# EAGLE design VCA-v2.1 (EAGLE 6.6.0)

## Sheet 1 of 2: Power
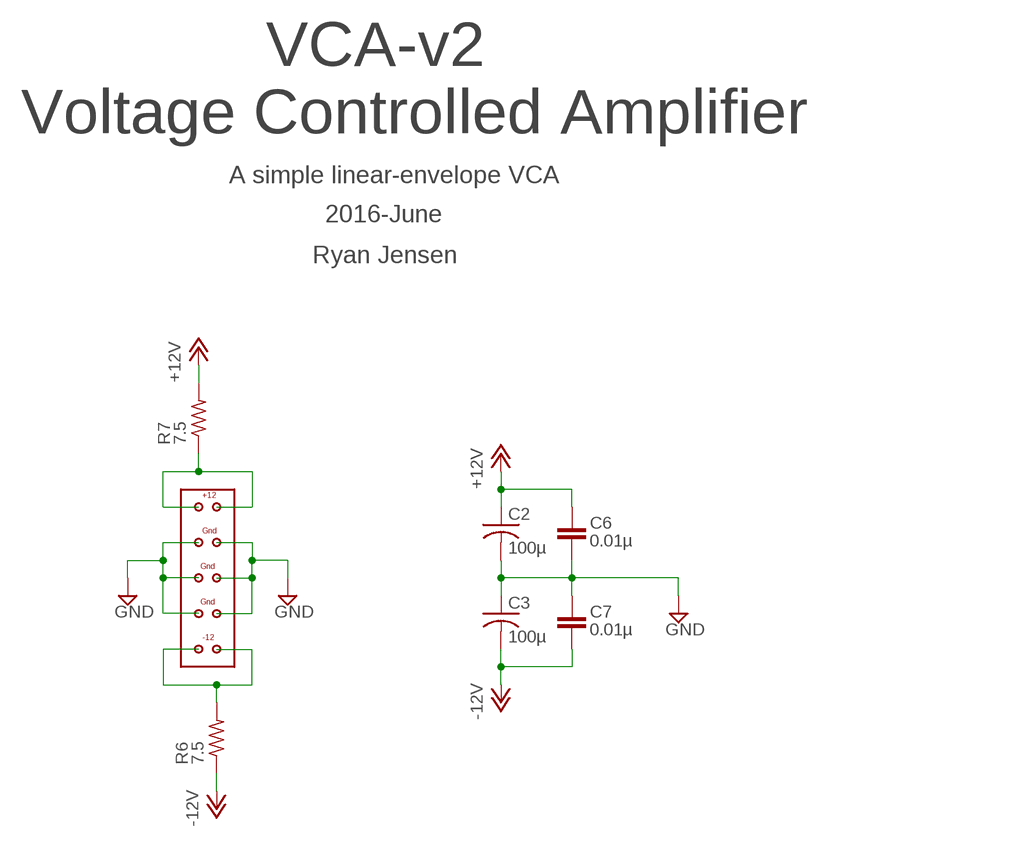
[diagram p0: schematic, sheet 1]

### Parts
C2  100µ  C-US025-050X050  [C025-050X050]
C3  100µ  C-US025-050X050  [C025-050X050]
C6  0.01µ  C-EUC0603  [C0603]
C7  0.01µ  C-EUC0603  [C0603]
R6  7.5  R-US_R0603  [R0603]
R7  7.5  R-US_R0603  [R0603]
U$1  EURORACK-POWER  [EURORACK-POWER]

### Nets
+12V: C2.1 C6.1 R7.2 ; also sheet 2
-12V: C3.2 C7.2 R6.1 ; also sheet 2
GND: C2.2 C3.1 C6.2 C7.1 U$1.P$3 U$1.P$4 U$1.P$5 U$1.P$6 U$1.P$7 U$1.P$8 ; also sheet 2
N$8: R6.2 U$1.P$9 U$1.P$10
N$10: R7.1 U$1.P$1 U$1.P$2

### Notes on the sheet
- VCA-v2
  Voltage Controlled Amplifier
- A simple linear-envelope VCA
- 2016-June
- Ryan Jensen

## Sheet 2 of 2
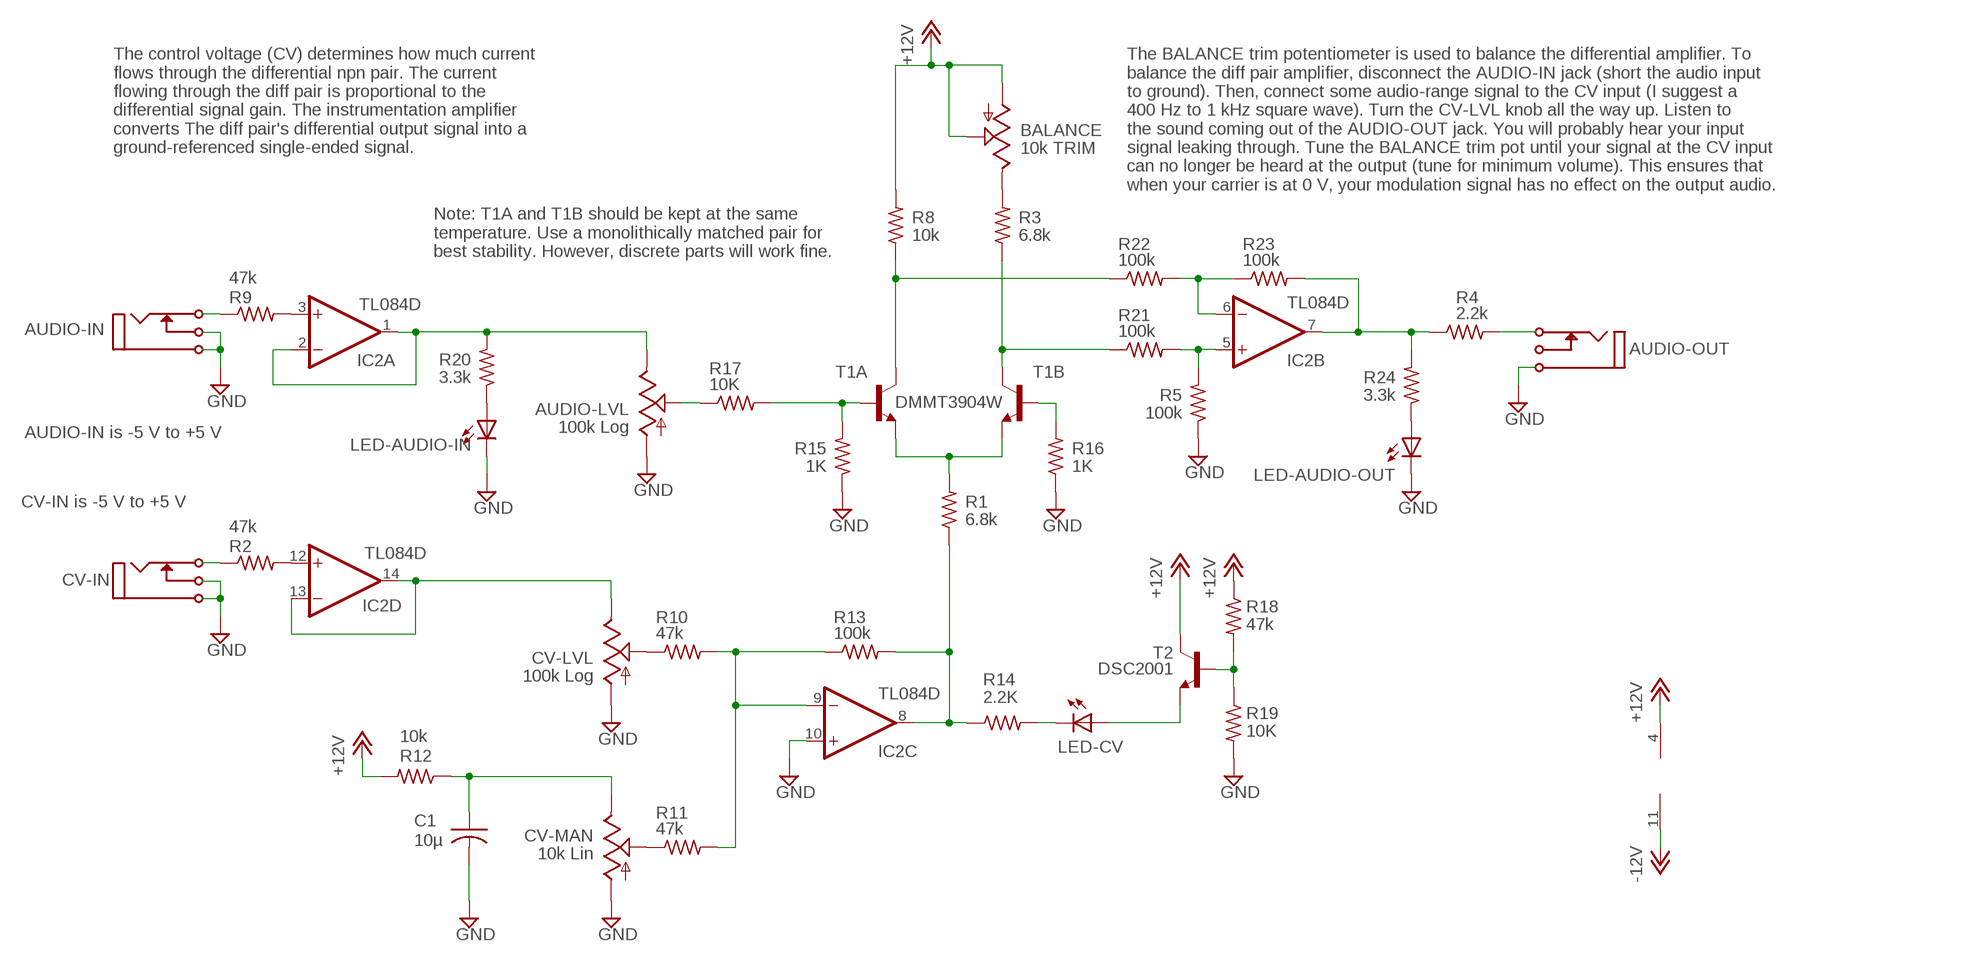
[diagram p1: schematic, sheet 2]

### Parts
AUDIO-IN  I/O  MONO_JACK  [MONO_JACK]
AUDIO-LVL  100k Log  TRIM_US-B64Y  [B64Y]
AUDIO-OUT  I/O  MONO_JACK  [MONO_JACK]
BALANCE  10k TRIM  TRIM_US-B64Y  [B64Y]
C1  10µ  C-US025-050X050  [C025-050X050]
CV-IN  I/O  MONO_JACK  [MONO_JACK]
CV-LVL  100k Log  TRIM_US-B64Y  [B64Y]
CV-MAN  10k Lin  TRIM_US-B64Y  [B64Y]
IC2  TL084D  [SO14]
LED-AUDIO-IN  TLLG4400  [LED3MM]
LED-AUDIO-OUT  TLLG4400  [LED3MM]
LED-CV  TLLG4400  [LED3MM]
R1  6.8k  R-US_R0603  [R0603]
R2  47k  R-US_R0603  [R0603]
R3  6.8k  R-US_R0603  [R0603]
R4  2.2k  R-US_R0603  [R0603]
R5  100k  R-US_R0603  [R0603]
R8  10k  R-US_R0603  [R0603]
R9  47k  R-US_R0603  [R0603]
R10  47k  R-US_R0603  [R0603]
R11  47k  R-US_R0603  [R0603]
R12  10k  R-US_R0603  [R0603]
R13  100k  R-US_R0603  [R0603]
R14  2.2K  R-US_R0603  [R0603]
R15  1K  R-US_R0603  [R0603]
R16  1K  R-US_R0603  [R0603]
R17  10K  R-US_R0603  [R0603]
R18  47k  R-US_R0603  [R0603]
R19  10K  R-US_R0603  [R0603]
R20  3.3k  R-US_R0603  [R0603]
R21  100k  R-US_R0603  [R0603]
R22  100k  R-US_R0603  [R0603]
R23  100k  R-US_R0603  [R0603]
R24  3.3k  R-US_R0603  [R0603]
T1  DMMT3904W  [SOT363]
T2  DSC2001  MMBT2222ALT1-NPN-SOT23-BEC  [SOT23-BEC]

### Nets
+12V: BALANCE.A BALANCE.S IC2.4(P:V+) R8.2 R12.2 R18.1 T2.C ; also sheet 1
-12V: IC2.11(P:V-) ; also sheet 1
GND: AUDIO-IN.P$1 AUDIO-IN.P$3(P3) AUDIO-LVL.A AUDIO-OUT.P$1 C1.2 CV-IN.P$1 CV-IN.P$3(P3) CV-LVL.A CV-MAN.A IC2.10(C:+IN) LED-AUDIO-IN.K(C) LED-AUDIO-OUT.K(C) R5.1 R15.1 R16.1 R19.2 ; also sheet 1
LED_SUPPLY: LED-CV.A T2.E
N$1: IC2.8(C:OUT) R1.1 R13.2 R14.1
N$2: BALANCE.E R3.2
N$3: IC2.12(D:+IN) R2.2
N$4: CV-LVL.E IC2.13(D:-IN) IC2.14(D:OUT)
N$5: CV-IN.P$2(P2) R2.1
N$6: AUDIO-IN.P$2(P2) R9.1
N$7: IC2.3(A:+IN) R9.2
N$9: AUDIO-LVL.E IC2.1(A:OUT) IC2.2(A:-IN) R20.2
N$11: CV-LVL.S R10.1
N$12: LED-CV.K(C) R14.2
N$13: CV-MAN.S R11.1
N$14: C1.1 CV-MAN.E R12.1
N$15: R1.2 T1.4(B:E) T1.5(A:E)
N$16: R15.2 R17.2 T1.1(A:B)
N$17: IC2.9(C:-IN) R10.2 R11.2 R13.1
N$18: AUDIO-LVL.S R17.1
N$19: R16.2 T1.2(B:B)
N$20: R18.2 R19.1 T2.B
N$21: LED-AUDIO-IN.A R20.1
N$22: LED-AUDIO-OUT.A R24.1
N$24: R8.1 R22.1 T1.6(A:C)
N$26: R3.1 R21.1 T1.3(B:C)
N$28: IC2.5(B:+IN) R5.2 R21.2
N$30: IC2.6(B:-IN) R22.2 R23.1
N$31: IC2.7(B:OUT) R4.1 R23.2 R24.2
N$32: AUDIO-OUT.P$2(P2) R4.2
Unconnected: AUDIO-OUT.P$3(P3)

### Notes on the sheet
- The control voltage (CV) determines how much current
  flows through the differential npn pair. The current
  flowing through the diff pair is proportional to the
  differential signal gain. The instrumentation amplifier
  converts The diff pair's differential output signal into a
  ground-referenced single-ended signal.
- The BALANCE trim potentiometer is used to balance the differential amplifier. To
  balance the diff pair amplifier, disconnect the AUDIO-IN jack (short the audio input
  to ground). Then, connect some audio-range signal to the CV input (I suggest a
  400 Hz to 1 kHz square wave). Turn the CV-LVL knob all the way up. Listen to
  the sound coming out of the AUDIO-OUT jack. You will probably hear your input
  signal leaking through. Tune the BALANCE trim pot until your signal at the CV input
  can no longer be heard at the output (tune for minimum volume). This ensures that
  when your carrier is at 0 V, your modulation signal has no effect on the output audio.
- Note: T1A and T1B should be kept at the same
  temperature. Use a monolithically matched pair for
  best stability. However, discrete parts will work fine.
- AUDIO-IN is -5 V to +5 V
- CV-IN is -5 V to +5 V

## Library data of the parts
AUDIO-IN AUDIO-OUT CV-IN = !synth_sch:MONO_JACK
AUDIO-LVL BALANCE CV-LVL CV-MAN = pot:TRIM_US-: POTENTIOMETER
C1-C3 = rcl:C-US: CAPACITOR, American symbol
C6 C7 = rcl:C-EU: CAPACITOR, European symbol
IC2 = linear:TL084: OP AMP
LED-AUDIO-IN LED-AUDIO-OUT LED-CV = led:TLLG4400: Low Current (2mA) LED 3 mm Tinted Diffused Package color GREEN Source: Data sheet <http://www.farnell.com/datasheets/391098.pdf>; MF: VISHAY SEMICONDUCTOR; OC_FARNELL: 1612435
R1-R24 = resistor:R-US_: RESISTOR, American symbol
T1 = !synth_sch:DMMT3904W
T2 = transistor:*-NPN-: NPN Transistror BF959 corrected 2008.03.06
U$1 = !synth_sch:EURORACK-POWER

## Board
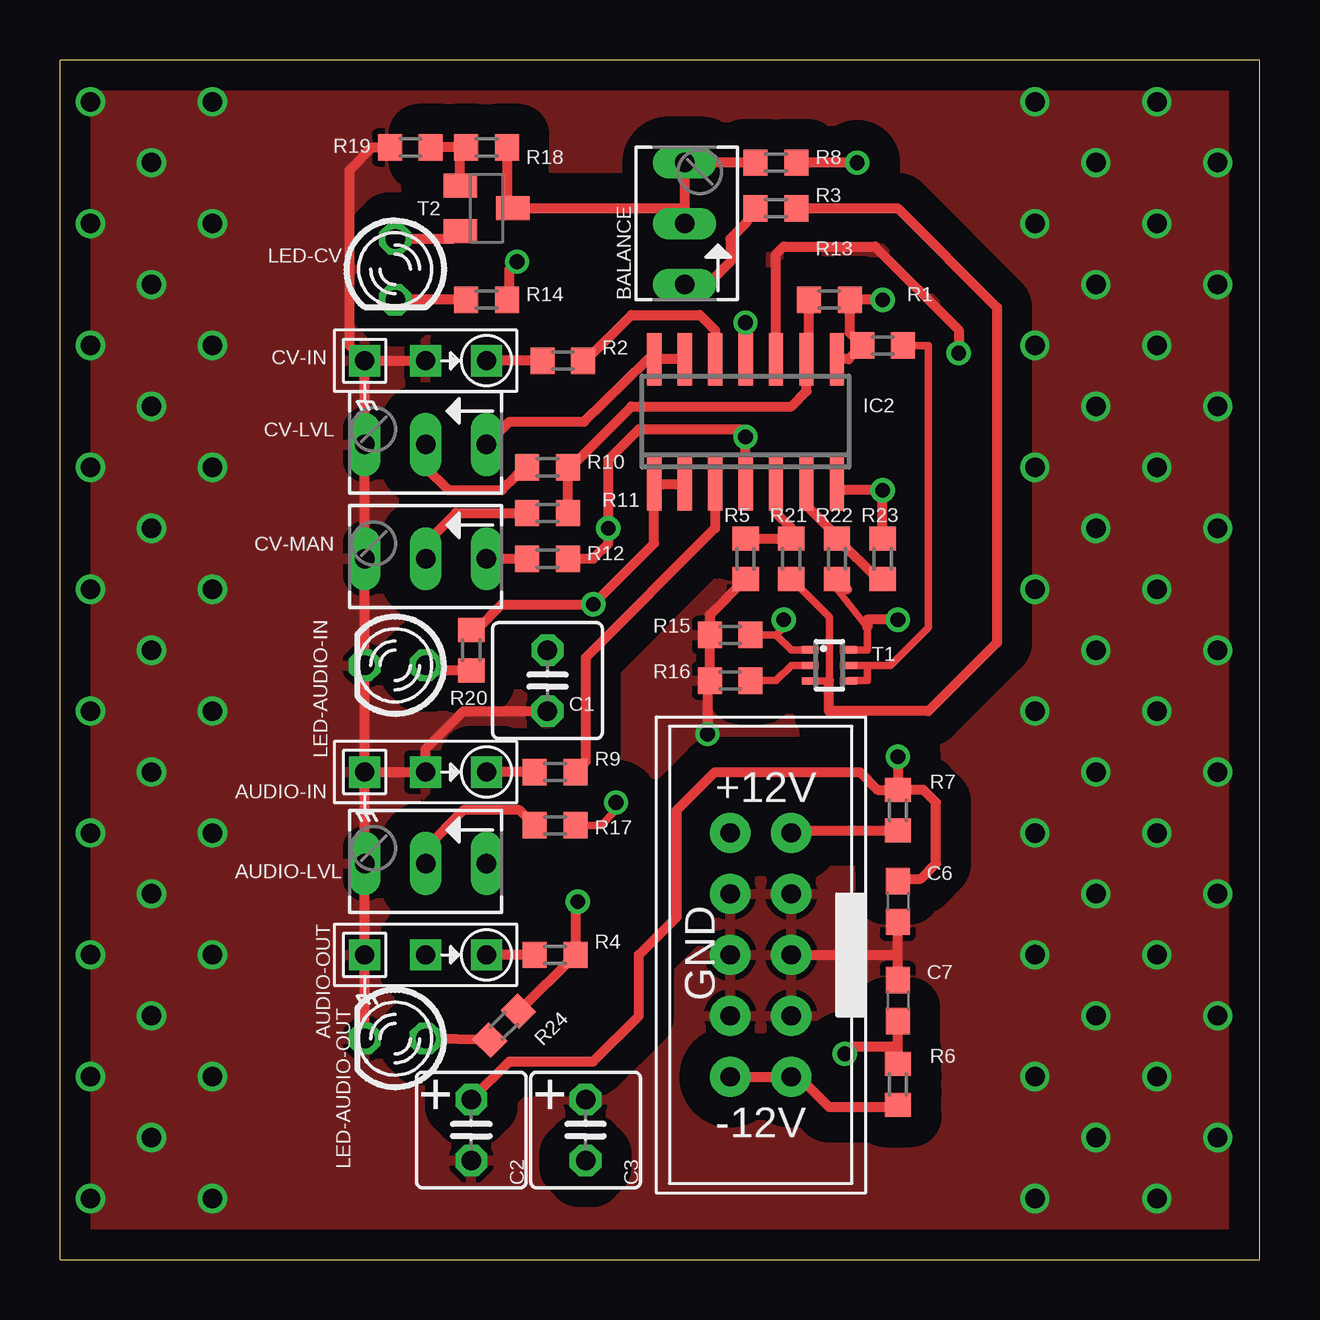
[diagram p2: board, top side]
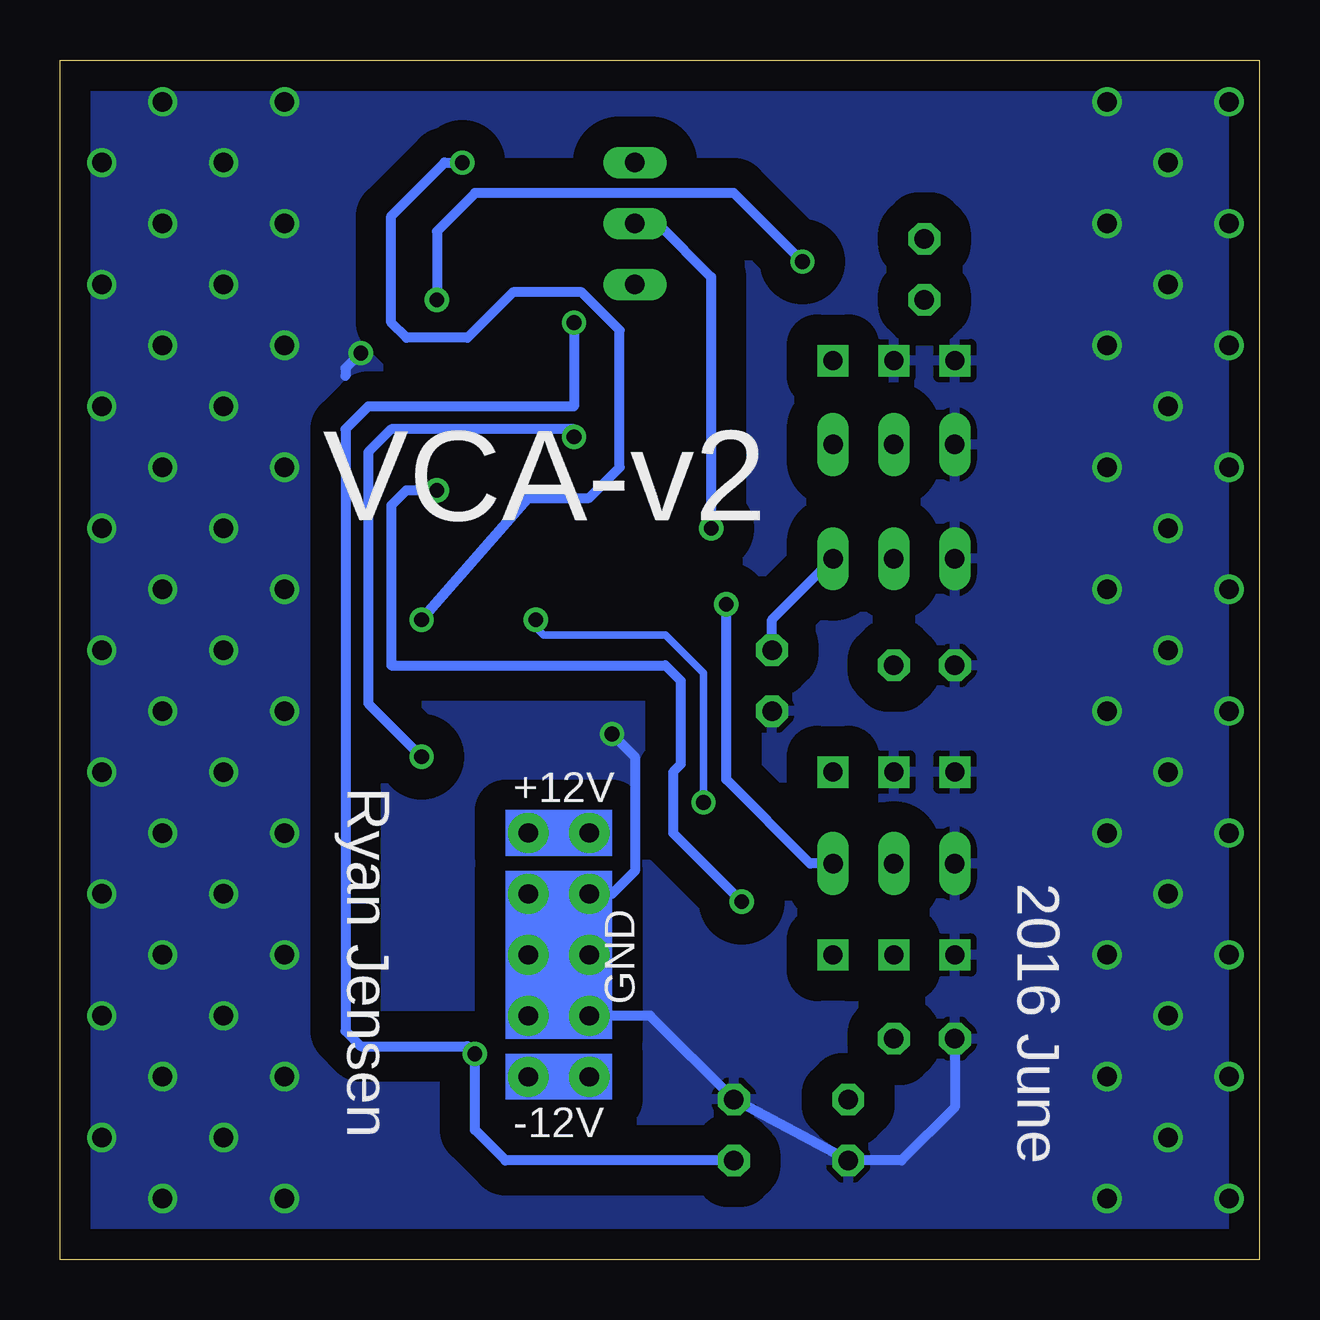
[diagram p3: board, bottom side, seen from below]

Size 50 x 50 mm. Coordinates in mm from the lower left corner, seen from the top.
Outline: 0,0 50,0 50,50 0,50 0,0
Copper layers (1*16): Top 0.035mm / dielectric 1.5mm / Bottom 0.035mm
Design rules "default": minimum track width 10mil, minimum drill 24mil, track to track 8mil, track to pad 8mil, pad to pad 8mil, via to via 8mil, smd to smd 8mil, copper to edge 40mil, drill to drill 8mil, minimum pad ring 10mil, minimum via ring 8mil, stop-mask expansion 4mil, vias tented up to drill 0mil, thermal gap 10mil

### Footprints (pad centres in the part's own frame; a part is rotated, then mirrored left to right if it is on the bottom)
MONO_JACK = drill 0.8 square: P$1 -2.54,0; P$2 2.54,0; P$3 0,0
B64Y = drill 0.813 long: A 2.54,0; E -2.54,0; S 0,0
C025-050X050 = drill 0.813 octagon: 1 -1.27,0; 2 1.27,0
C0603 = smd 1.1 x 1: 1 -0.85,0; 2 0.85,0
SO14 = smd 0.6 x 2.2: 1 -3.81,-2.6; 2 -2.54,-2.6; 3 -1.27,-2.6; 4 0,-2.6; 5 1.27,-2.6; 6 2.54,-2.6; 7 3.81,-2.6; 8 3.81,2.6; 9 2.54,2.6; 10 1.27,2.6; 11 0,2.6; 12 -1.27,2.6; 13 -2.54,2.6; 14 -3.81,2.6
LED3MM = drill 0.813 octagon: A -1.27,0; K 1.27,0
R0603 = smd 1 x 1.1: 1 -0.85,0; 2 0.85,0
SOT363 = smd 0.3 x 0.7: 1 -0.65,-0.8; 2 0,-0.8; 3 0.65,-0.8; 4 0.65,0.8; 5 0,0.8; 6 -0.65,0.8
SOT23-BEC = smd 1 x 1.4: B -0.95,-1.1; C 0,1.1; E 0.95,-1.1
EURORACK-POWER = drill 0.8 pad 1.676: P$1 -1.27,5.08; P$2 1.27,5.08; P$3 -1.27,2.54; P$4 1.27,2.54; P$5 -1.27,0; P$6 1.27,0; P$7 -1.27,-2.54; P$8 1.27,-2.54; P$9 -1.27,-5.08; P$10 1.27,-5.08

### Placement (x,y rotation side)
AUDIO-IN  15.24,20.32 0 top
AUDIO-LVL  15.24,16.51 180 top
AUDIO-OUT  15.24,12.7 0 top
BALANCE  26.04,43.18 90 top
C1  20.32,24.13 270 top
C2  17.14,5.4 270 top
C3  21.91,5.4 270 top
C6  34.92,14.92 270 top
C7  34.92,10.79 270 top
CV-IN  15.24,37.47 0 top
CV-LVL  15.24,33.97 180 top
CV-MAN  15.24,29.21 180 top
IC2  28.57,34.92 0 top
LED-AUDIO-IN  13.97,24.77 180 top
LED-AUDIO-OUT  13.97,9.21 180 top
LED-CV  13.97,41.27 270 top
R1  34.29,38.1 0 top
R2  20.95,37.47 0 top
R3  29.84,43.81 180 top
R4  20.64,12.7 180 top
R5  28.57,29.21 90 top
R6  34.92,7.3 270 top
R7  34.92,18.73 90 top
R8  29.84,45.72 180 top
R9  20.64,20.32 0 top
R10  20.32,33.02 0 top
R11  20.32,31.11 0 top
R12  20.32,29.21 0 top
R13  32.07,40.01 0 top
R14  17.78,40.01 180 top
R15  27.94,26.04 0 top
R16  27.94,24.13 0 top
R17  20.64,18.1 0 top
R18  17.78,46.35 180 top
R19  14.61,46.35 180 top
R20  17.14,25.4 90 top
R21  30.48,29.21 90 top
R22  32.38,29.21 90 top
R23  34.29,29.21 90 top
R24  18.51,9.75 45 top
T1  32.07,24.77 270 top
T2  MMBT2222ALT1  [SOT23-BEC]  17.78,43.81 270 top
U$1  29.21,12.7 0 top

### Tracks (layer width: path | path; a pad name or v marks a point on that pad's centre or on a via)
+12V  (via drill 0.61, 0.61 pad 0.61)
  Top 0.406: R18.1 18.63,44.06 T2.C 26.04,43.81 | R12.2 22.23,29.21 22.86,29.84 v22.86,30.48 22.86,33.34 24.13,34.61 28.57,34.61 v28.57,34.29 IC2.4 | 26.04,43.81 BALANCE.A R8.2 | 26.04,43.81 BALANCE.S | C6.1 35.03,15.88 35.88,15.88 36.51,16.51 36.51,19.05 35.98,19.58 R7.2 | C2.1 18.73,8.26 22.23,8.26 24.13,10.16 24.13,12.7 25.72,14.29 25.72,18.73 27.3,20.32 33.34,20.32 34.08,19.58 R7.2 | v34.92,20.95 R7.2
  Bottom 0.406: v28.57,34.29 28.57,34.61 36.2,34.61 37.15,33.66 37.15,23.18 v34.92,20.95 | BALANCE.S 25.08,43.18 22.86,40.96 v22.86,30.48
-12V  (via drill 0.61)
  Top 0.406: IC2.11 v28.57,39.05 | R6.1 34.92,8.89 | 34.92,8.89 C7.2 | v32.7,8.57 33.02,8.89 34.92,8.89
  Bottom 0.406: v28.57,39.05 28.57,35.56 37.15,35.56 38.1,34.61 38.1,9.53 37.47,8.89 33.02,8.89 v32.7,8.57 32.7,5.4 31.43,4.13 C3.2
GND  (via drill 0.61, 0.81)
  Top 0.406: LED-AUDIO-OUT.K AUDIO-OUT.P$1 AUDIO-LVL.A AUDIO-IN.P$1 | AUDIO-IN.P$1 AUDIO-IN.P$3 15.24,21.27 16.83,22.86 C1.2 | AUDIO-IN.P$1 LED-AUDIO-IN.K CV-MAN.A CV-LVL.A CV-IN.P$1 | CV-IN.P$1 CV-IN.P$3 | CV-IN.P$1 12.06,38.1 12.06,45.4 13.02,46.35 R19.2 | R5.1 27.09,26.88 R15.1 R16.1 26.99,24.03 v26.99,21.91 | C7.1 34.92,12.7 | 34.92,12.7 C6.2 | U$1.P$6 34.92,12.7 | IC2.10 29.84,41.91 30.16,42.23 33.97,42.23 37.47,38.73 v37.47,37.78
  Bottom 0.406: U$1.P$4 U$1.P$3 | U$1.P$3 U$1.P$5 U$1.P$6 U$1.P$8 U$1.P$7 25.4,10.16 C3.1 C2.2 14.92,4.13 12.7,6.35 LED-AUDIO-OUT.K | v26.99,21.91 26.04,20.95 26.04,16.19 26.99,15.24 U$1.P$3 | v37.47,37.78 38.1,37.15 38.1,36.83
  other vias: 1.27,33.02 3.81,30.48 1.27,27.94 3.81,25.4 1.27,22.86 3.81,20.32 1.27,17.78 3.81,15.24 1.27,12.7 3.81,10.16 1.27,7.62 3.81,5.08 1.27,2.54 6.35,17.78 6.35,12.7 6.35,7.62 6.35,2.54 6.35,33.02 6.35,27.94 6.35,22.86 1.27,48.26 3.81,45.72 1.27,43.18 3.81,40.64 1.27,38.1 3.81,35.56 6.35,48.26 6.35,43.18 6.35,38.1 40.64,48.26 43.18,45.72 40.64,43.18 43.18,40.64 40.64,38.1 43.18,35.56 45.72,48.26 48.26,45.72 45.72,43.18 48.26,40.64 45.72,38.1 48.26,35.56 45.72,33.02 48.26,30.48 45.72,27.94 48.26,25.4 45.72,22.86 48.26,20.32 40.64,33.02 43.18,30.48 40.64,27.94 43.18,25.4 40.64,22.86 43.18,20.32 45.72,17.78 48.26,15.24 45.72,12.7 48.26,10.16 45.72,7.62 48.26,5.08 45.72,2.54 40.64,17.78 43.18,15.24 40.64,12.7 43.18,10.16 40.64,7.62 43.18,5.08 40.64,2.54
  pour Bottom (isolate 1.27): 0,0 0,50 50,50 50,0
  pour Top (isolate 1.27): 0,0 0,50 50,50 50,0
LED_SUPPLY
  Top 0.406: LED-CV.A 16.36,42.55 T2.E
N$1  (via drill 0.61)
  Top 0.406: IC2.8 32.87,37.52 R1.1 32.92,38.62 R13.2 v34.29,40.01 | R14.1 18.73,40.11 18.73,41.27 v19.05,41.59
  Bottom 0.406: v19.05,41.59 21.91,44.45 32.7,44.45 34.29,42.86 v34.29,40.01
N$2
  Top 0.406: R3.2 28.57,43.18 27.94,42.55 27.94,41.59 26.99,40.64 BALANCE.E
N$3
  Top 0.406: R2.2 21.91,37.47 23.81,39.37 26.67,39.37 27.3,38.73 IC2.12
N$4
  Top 0.406: IC2.13 IC2.14 24.51,37.52 24.45,37.47 21.85,34.92 18.73,34.92 CV-LVL.E
N$5
  Top 0.406: R2.1 CV-IN.P$2
N$6
  Top 0.406: R9.1 AUDIO-IN.P$2
N$7
  Top 0.406: IC2.3 27.3,30.48 21.91,25.08 21.91,20.74 R9.2
N$8
  Top 0.406: R6.2 34.82,6.35 32.07,6.35 30.8,7.62 U$1.P$10 U$1.P$9
N$9  (via drill 0.61 pad 0.61)
  Top 0.406: IC2.2 IC2.1 24.77,29.84 v22.23,27.3 | R20.2 17.36,26.25 18.41,27.3 v22.23,27.3 | v22.23,27.3 22.54,27.3
  Bottom 0.406: AUDIO-LVL.E 18.73,16.51 22.23,20 v22.23,27.3
N$10
  Top 0.406: U$1.P$2 30.58,17.88 R7.1
  Bottom 0.406: U$1.P$1 U$1.P$2
N$11
  Top 0.406: CV-LVL.S 15.24,33.02 16.19,32.07 18.41,32.07 19.05,32.7 19.37,33.12 R10.1
N$12
  Top 0.406: R14.2 LED-CV.K
N$13
  Top 0.406: CV-MAN.S 15.24,29.84 16.51,31.11 R11.1
N$14
  Top 0.406: CV-MAN.E R12.1
  Bottom 0.406: C1.1 20.32,26.67 CV-MAN.E
N$15
  Top 0.305: T1.4 32.88,24.13 33.66,24.13 33.66,24.77 | T1.5 33.66,24.77 | 33.66,24.77 34.61,24.77 36.2,26.35 36.2,38.1 R1.2
N$16  (via drill 0.61, 0.61 pad 0.61)
  Top 0.305: T1.1 31.25,25.4 30.48,25.4 29.84,26.04 | R15.2 29.84,26.04 | 29.84,26.04 30.16,26.35 v30.16,26.67 | v23.18,19.05 23.18,18.73 22.54,18.1 R17.2
  Bottom 0.305: v30.16,26.67 30.16,26.35 29.84,26.04 24.77,26.04 23.18,24.45 v23.18,19.05
N$17
  Top 0.406: R11.2 R10.2 21.27,33.02 23.81,35.56 30.48,35.56 31.11,36.2 IC2.9 31.22,37.63 R13.1
N$18
  Top 0.406: R17.1 19.15,18.73 16.83,18.73 15.24,17.14 AUDIO-LVL.S
N$19
  Top 0.305: T1.2 30.48,24.77 29.84,24.13 R16.2
N$20
  Top 0.406: T2.B 16.68,46.1 R18.2 R19.1
N$21
  Top 0.406: R20.1 15.46,24.55 LED-AUDIO-IN.A
N$22
  Top 0.406: R24.1 LED-AUDIO-OUT.A
N$24  (via drill 0.61, 0.61 pad 0.61)
  Top 0.305: T1.6 32.88,25.4 33.66,25.4 33.66,26.35 32.38,27.94 R22.1
  Top 0.406: 32.23,28.21 R22.1 32.8,27.94 | v33.23,45.72 R8.1 | v34.92,26.67 33.66,26.67 33.66,26.35
  Bottom 0.406: v34.92,26.67 30.48,31.75 27.94,31.75 26.67,33.02 26.67,38.73 28.26,40.32 31.11,40.32 33.02,38.42 35.56,38.42 36.2,39.05 36.2,43.5 33.97,45.72 v33.23,45.72
N$26
  Top 0.305: R21.1 32.07,26.77 32.07,24.13 32.05,24.11 T1.3
  Top 0.406: R3.1 34.92,43.81 39.05,39.69 39.05,25.72 36.2,22.86 32.07,22.86 32.05,22.88 32.05,24.11
N$28
  Top 0.406: IC2.5 29.84,31.11 30.48,30.48 R21.2 R5.2
N$30
  Top 0.406: R22.2 32.38,30.16 31.11,31.43 IC2.6 | R22.2 32.59,30.06 | R23.1 34.09,28.36 R22.2
N$31  (via drill 0.61, 0.61 pad 0.61)
  Top 0.406: R24.2 R4.1 21.49,14.82 v21.59,14.92 | R23.2 v34.29,32.07 32.64,32.07 IC2.7
  Bottom 0.406: v21.59,14.92 24.45,17.78 24.45,20.32 24.13,20.64 24.13,24.13 24.77,24.77 36.2,24.77 36.2,31.43 35.56,32.07 v34.29,32.07
N$32
  Top 0.406: R4.2 AUDIO-OUT.P$2

### Text on the board
tNames: + | +
bNames: VCA-v2 | Ryan Jensen | 2016 June